# Altium schematic sheet MCU.SchDoc
size A3
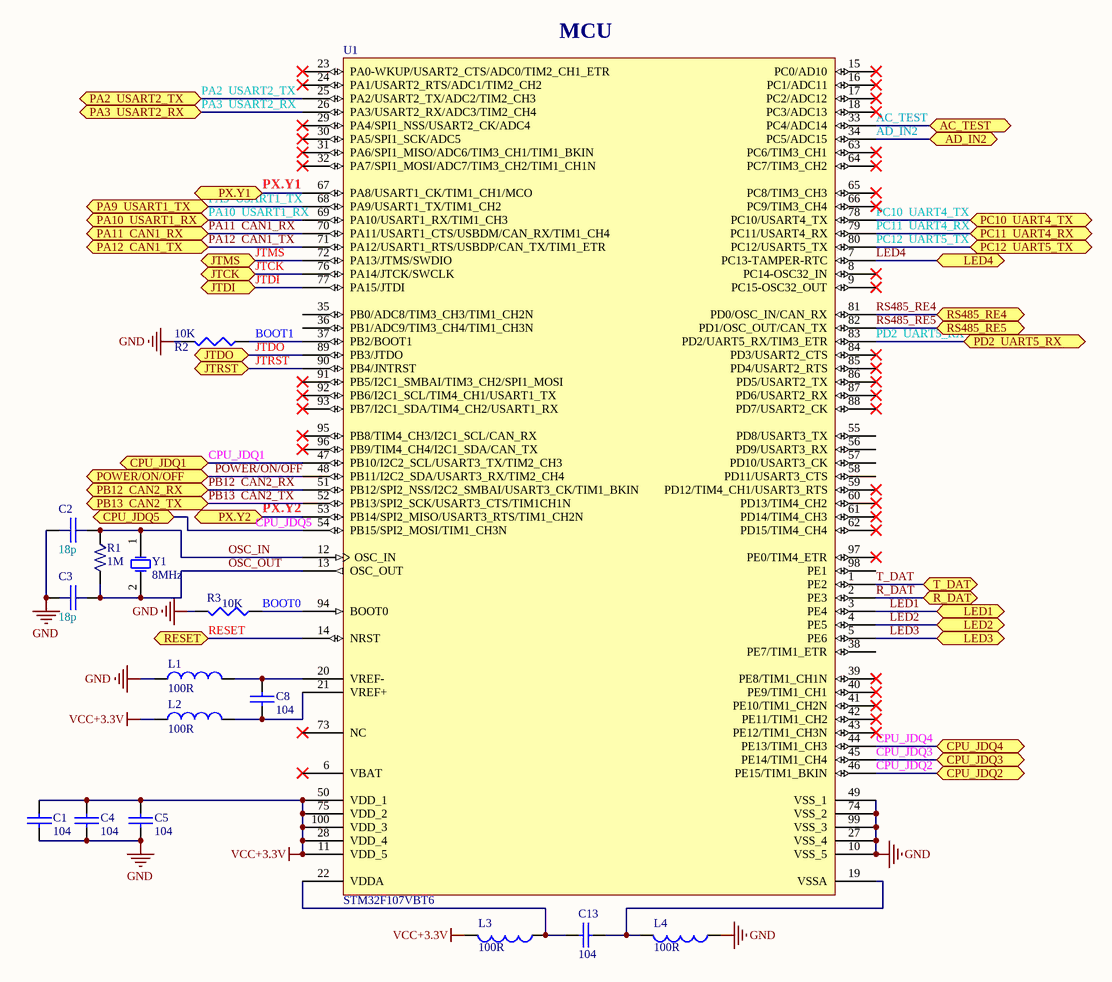
[diagram p0: MCU.SchDoc]

## Parts
C1  104  [0603]
C2  18p  [0603]
C3  18p  [0603]
C4  104  [0603]
C5  104  [0603]
C8  104  [0603]
C13  104  [0603]
L1  100R  [0805]
L2  100R  [0805]
L3  100R  [0805]
L4  100R  [0805]
R1  1M  [0805]
R2  10K  [0603]
R3  10K  [0603]
U1  STM32F107VBT6  [LQFP100_L]
Y1  8MHz  [XTAL_US]

## Ports
AC_TEST, AD_IN2, CPU_JDQ1, CPU_JDQ2, CPU_JDQ3, CPU_JDQ4, CPU_JDQ5, JTCK, JTDI, JTDO, JTMS, JTRST, LED1, LED2, LED3, LED4, PA2  USART2_TX, PA3  USART2_RX, PA9  USART1_TX, PA10  USART1_RX, PA11  CAN1_RX, PA12  CAN1_TX, PB12  CAN2_RX, PB13  CAN2_TX, PC10  UART4_TX, PC11  UART4_RX, PC12  UART5_TX, PD2  UART5_RX, POWER/ON/OFF, PX.Y1, PX.Y2, R_DAT, RESET, RS485_RE4, RS485_RE5, T_DAT

## Nets
GND: C1.2 C2.2 C3.2 C4.2 C5.2 L1.1 L4.1 R2.2 R3.2 U1.10(VSS_5) U1.27(VSS_4) U1.49(VSS_1) U1.74(VSS_2) U1.99(VSS_3)
VCC+3.3V: C1.1 C4.1 C5.1 L2.1 L3.2 U1.11(VDD_5) U1.28(VDD_4) U1.50(VDD_1) U1.75(VDD_2) U1.100(VDD_3)
AC_TEST: U1.33(PC4/ADC14) ; port AC_TEST
AD_IN2: U1.34(PC5/ADC15) ; port AD_IN2
BOOT0: R3.1 U1.94(BOOT0)
BOOT1: R2.1 U1.37(PB2/BOOT1)
CPU_JDQ1: U1.47(PB10/I2C2_SCL/USART3_TX/TIM2_CH3) ; port CPU_JDQ1
CPU_JDQ2: U1.46(PE15/TIM1_BKIN) ; port CPU_JDQ2
CPU_JDQ3: U1.45(PE14/TIM1_CH4) ; port CPU_JDQ3
CPU_JDQ4: U1.44(PE13/TIM1_CH3) ; port CPU_JDQ4
CPU_JDQ5: U1.54(PB15/SPI2_MOSI/TIM1_CH3N) ; port CPU_JDQ5
JTCK: U1.76(PA14/JTCK/SWCLK) ; port JTCK
JTDI: U1.77(PA15/JTDI) ; port JTDI
JTDO: U1.89(PB3/JTDO) ; port JTDO
JTMS: U1.72(PA13/JTMS/SWDIO) ; port JTMS
JTRST: U1.90(PB4/JNTRST) ; port JTRST
LED1: U1.3(PE4) ; port LED1
LED2: U1.4(PE5) ; port LED2
LED3: U1.5(PE6) ; port LED3
LED4: U1.7(PC13-TAMPER-RTC) ; port LED4
OSC_IN: C2.1 R1.1 U1.12(OSC_IN) Y1.1(OSC1)
OSC_OUT: C3.1 R1.2 U1.13(OSC_OUT) Y1.2(OSC2)
PA2  USART2_TX: U1.25(PA2/USART2_TX/ADC2/TIM2_CH3) ; port PA2  USART2_TX
PA3  USART2_RX: U1.26(PA3/USART2_RX/ADC3/TIM2_CH4) ; port PA3  USART2_RX
PA9  USART1_TX: U1.68(PA9/USART1_TX/TIM1_CH2) ; port PA9  USART1_TX
PA10  USART1_RX: U1.69(PA10/USART1_RX/TIM1_CH3) ; port PA10  USART1_RX
PA11  CAN1_RX: U1.70(PA11/USART1_CTS/USBDM/CAN_RX/TIM1_CH4) ; port PA11  CAN1_RX
PA12  CAN1_TX: U1.71(PA12/USART1_RTS/USBDP/CAN_TX/TIM1_ETR) ; port PA12  CAN1_TX
PB12  CAN2_RX: U1.51(PB12/SPI2_NSS/I2C2_SMBAI/USART3_CK/TIM1_BKIN) ; port PB12  CAN2_RX
PB13  CAN2_TX: U1.52(PB13/SPI2_SCK/USART3_CTS/TIM1CH1N) ; port PB13  CAN2_TX
PC10  UART4_TX: U1.78(PC10/USART4_TX) ; port PC10  UART4_TX
PC11  UART4_RX: U1.79(PC11/USART4_RX) ; port PC11  UART4_RX
PC12  UART5_TX: U1.80(PC12/USART5_TX) ; port PC12  UART5_TX
PD2  UART5_RX: U1.83(PD2/UART5_RX/TIM3_ETR) ; port PD2  UART5_RX
POWER/ON/OFF: U1.48(PB11/I2C2_SDA/USART3_RX/TIM2_CH4) ; port POWER/ON/OFF
PX.Y1: U1.67(PA8/USART1_CK/TIM1_CH1/MCO) ; port PX.Y1
PX.Y2: U1.53(PB14/SPI2_MISO/USART3_RTS/TIM1_CH2N) ; port PX.Y2
R_DAT: U1.2(PE3) ; port R_DAT
RESET: U1.14(NRST) ; port RESET
RS485_RE4: U1.81(PD0/OSC_IN/CAN_RX) ; port RS485_RE4
RS485_RE5: U1.82(PD1/OSC_OUT/CAN_TX) ; port RS485_RE5
T_DAT: U1.1(PE2) ; port T_DAT
NetC8_1: C8.1 L1.2 U1.20(VREF-)
NetC8_2: C8.2 L2.2 U1.21(VREF+)
NetC13_1: C13.1 L3.1 U1.22(VDDA)
NetC13_2: C13.2 L4.2 U1.19(VSSA)

Not connected (* = marked no-connect by the designer): U1 6(VBAT)* 8(PC14-OSC32_IN)* 9(PC15-OSC32_OUT)* 15(PC0/AD10)* 16(PC1/ADC11)* 17(PC2/ADC12)* 18(PC3/ADC13)* 23(PA0-WKUP/USART2_CTS/ADC0/TIM2_CH1_ETR)* 24(PA1/USART2_RTS/ADC1/TIM2_CH2)* 29(PA4/SPI1_NSS/USART2_CK/ADC4)* 30(PA5/SPI1_SCK/ADC5)* 31(PA6/SPI1_MISO/ADC6/TIM3_CH1/TIM1_BKIN)* 32(PA7/SPI1_MOSI/ADC7/TIM3_CH2/TIM1_CH1N)* 35(PB0/ADC8/TIM3_CH3/TIM1_CH2N) 36(PB1/ADC9/TIM3_CH4/TIM1_CH3N) 38(PE7/TIM1_ETR) 39(PE8/TIM1_CH1N)* 40(PE9/TIM1_CH1)* 41(PE10/TIM1_CH2N)* 42(PE11/TIM1_CH2)* 43(PE12/TIM1_CH3N)* 55(PD8/USART3_TX) 56(PD9/USART3_RX) 57(PD10/USART3_CK) 58(PD11/USART3_CTS) 59(PD12/TIM4_CH1/USART3_RTS)* 60(PD13/TIM4_CH2)* 61(PD14/TIM4_CH3)* 62(PD15/TIM4_CH4)* 63(PC6/TIM3_CH1)* 64(PC7/TIM3_CH2)* 65(PC8/TIM3_CH3)* 66(PC9/TIM3_CH4)* 73(NC)* 84(PD3/USART2_CTS)* 85(PD4/USART2_RTS)* 86(PD5/USART2_TX)* 87(PD6/USART2_RX)* 88(PD7/USART2_CK)* 91(PB5/I2C1_SMBAI/TIM3_CH2/SPI1_MOSI)* 92(PB6/I2C1_SCL/TIM4_CH1/USART1_TX)* 93(PB7/I2C1_SDA/TIM4_CH2/USART1_RX)* 95(PB8/TIM4_CH3/I2C1_SCL/CAN_RX)* 96(PB9/TIM4_CH4/I2C1_SDA/CAN_TX)* 97(PE0/TIM4_ETR)* 98(PE1)

## Notes on the sheet
- (near U1) MCU

## Library data of the parts
C1 C4 C5 C8 C13 = CAP
C2 C3 = CAP: 陶瓷电容
L1-L4 = INDUCTOR
R1 = RES-1%: 高精度电阻
R2 R3 = RES1
Y1 = XTAL: Crystal Oscillator; Published: 8-Jun-2000; LatestRevisionDate: 17-Jul-2002; LatestRevisionNote: Re-released for DXP Platform.; Publisher: Altium Limited